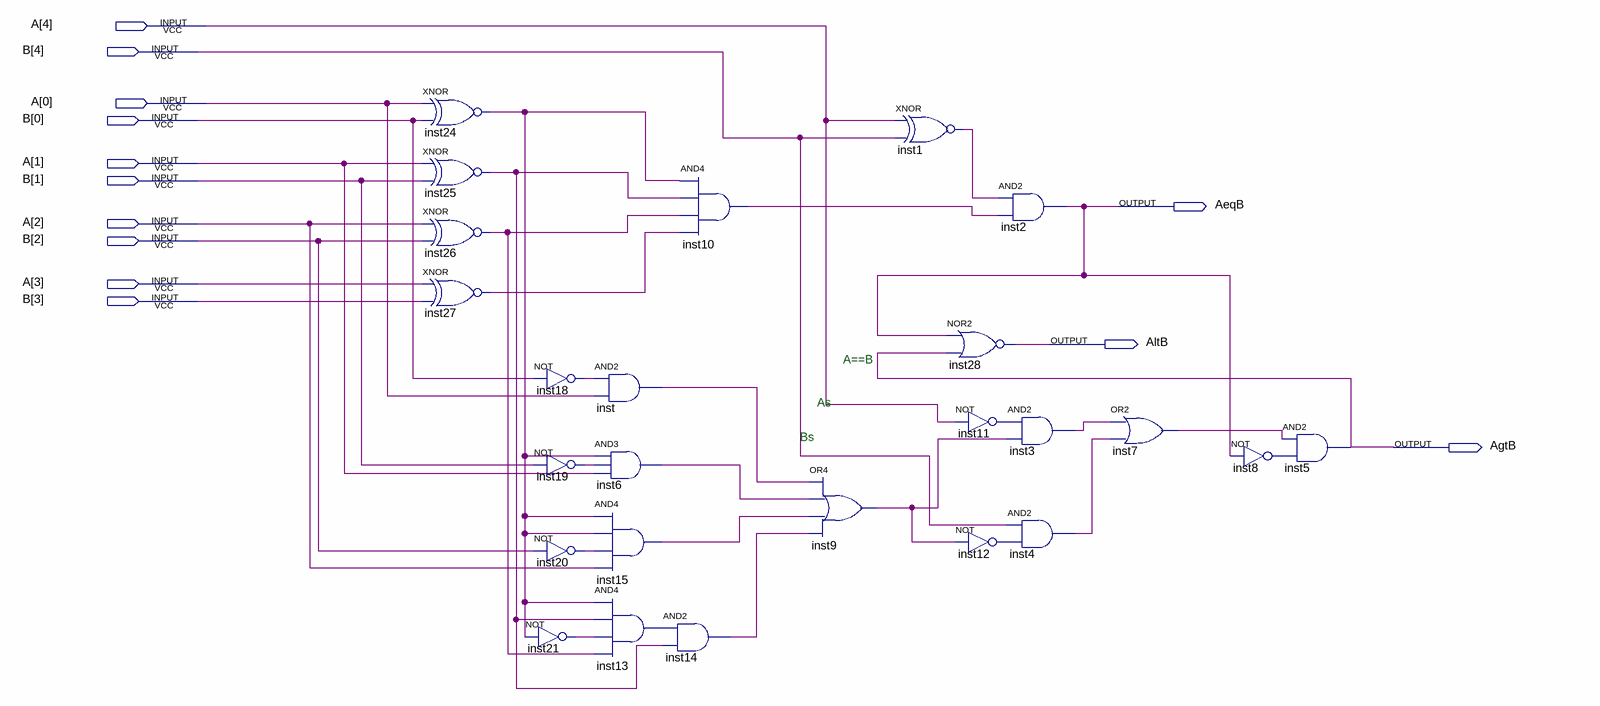
[diagram p0: schematic sheet]
// Quartus schematic ComparadordeMagnitude4Bits.bdf as structural Verilog: 25 symbols, 13 pins
module ComparadordeMagnitude4Bits (
  input  [4:0] A,
  input  [4:0] B,
  output AeqB,
  output AltB,
  output AgtB
);

  wire inst1_out, inst3_out, inst4_out, inst6_out, inst7_out, inst8_out, inst9_out, inst10_out, inst11_out,
       inst12_out, inst13_out, inst14_out, inst15_out, inst18_out, inst19_out, inst20_out, inst21_out,
       inst24_out, inst25_out, inst26_out, inst27_out, inst_out;

  xnor inst24 (inst24_out, A[0], B[0]);
  xnor inst25 (inst25_out, A[1], B[1]);
  xnor inst26 (inst26_out, A[2], B[2]);
  xnor inst27 (inst27_out, A[3], B[3]);
  not inst18 (inst18_out, B[0]);
  not inst19 (inst19_out, B[1]);
  not inst20 (inst20_out, B[2]);
  not inst21 (inst21_out, inst24_out);
  and inst (inst_out, inst18_out, A[0]);
  and inst6 (inst6_out, inst24_out, inst19_out, A[1]);
  and inst15 (inst15_out, inst24_out, inst24_out, inst20_out, A[2]);
  and inst13 (inst13_out, inst24_out, inst25_out, inst21_out, inst26_out);
  and inst10 (inst10_out, inst24_out, inst25_out, inst26_out, inst27_out);
  and inst14 (inst14_out, inst13_out, inst25_out);
  or inst9 (inst9_out, inst_out, inst6_out, inst15_out, inst14_out);
  xnor inst1 (inst1_out, A[4], B[4]);
  nor inst28 (AltB, AeqB, AgtB);
  not inst11 (inst11_out, A[4]);
  not inst12 (inst12_out, inst9_out);
  and inst2 (AeqB, inst1_out, inst10_out);
  and inst3 (inst3_out, inst11_out, inst9_out);
  and inst4 (inst4_out, B[4], inst12_out);
  or inst7 (inst7_out, inst3_out, inst4_out);
  not inst8 (inst8_out, AeqB);
  and inst5 (AgtB, inst7_out, inst8_out);

  // Notes on the sheet:
  //   A==B
  //   As
  //   Bs
endmodule
